# Altium schematic sheet USBC.SchDoc
size C; SheetNumber: 5; SheetTotal: 9
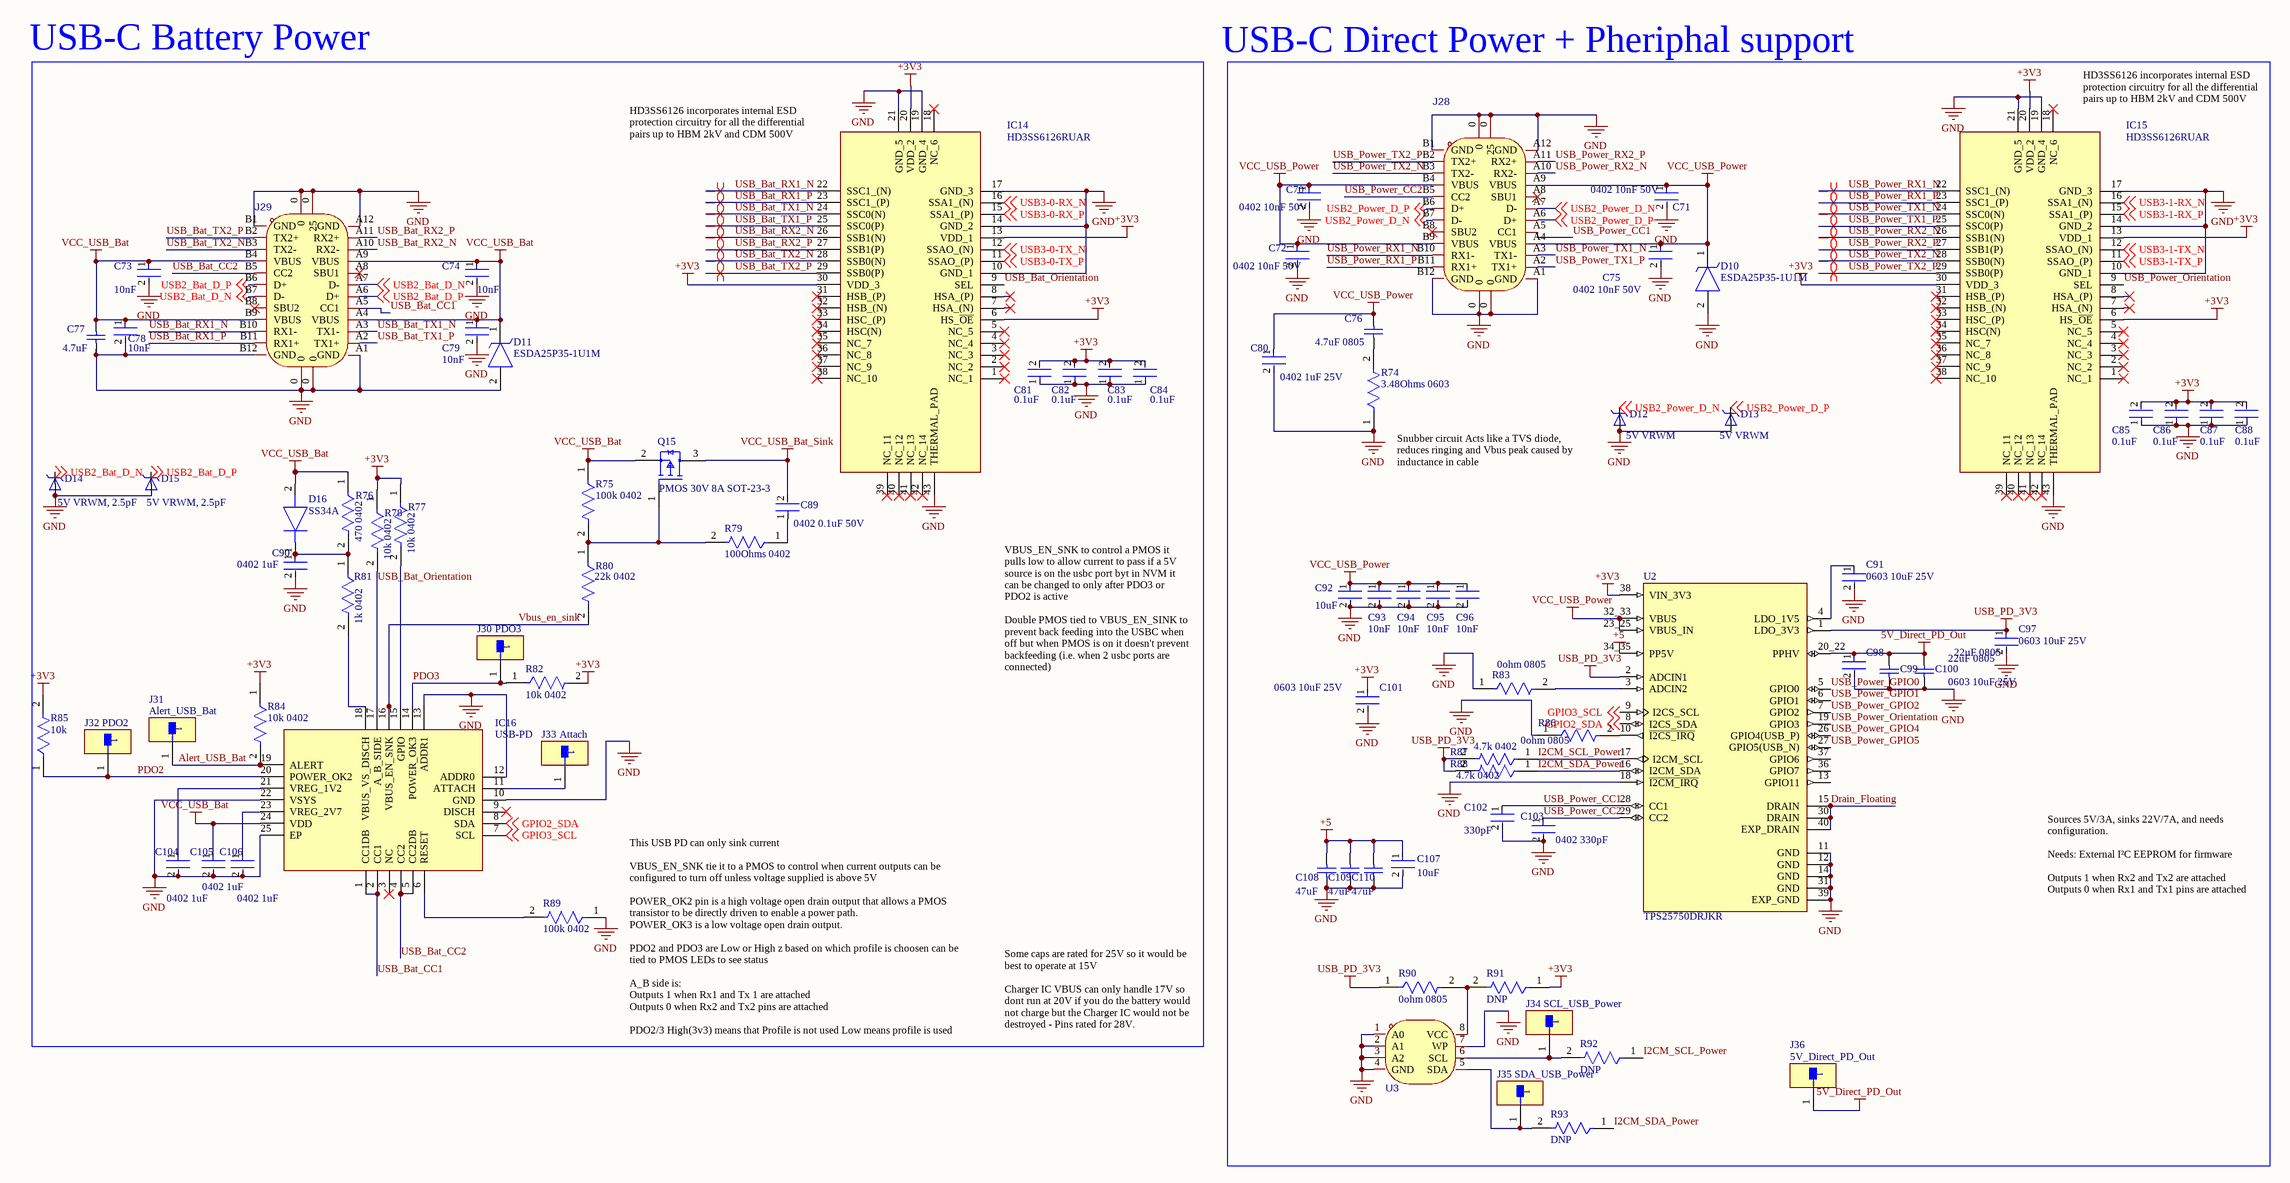
[diagram p0: USBC.SchDoc]

## Parts
C70  0402 10nF 50V  [FP-C0402-BB-MFG]
C71  0402 10nF 50V  [FP-C0402-BB-MFG]
C72  0402 10nF 50V  [FP-C0402-BB-MFG]
C73  10nF  [FP-C0402-BB-MFG]
C74  10nF  [FP-C0402-BB-MFG]
C75  0402 10nF 50V  [FP-C0402-BB-MFG]
C76  4.7uF 0805  [CAPC2013X145X50ML20T25]
C77  4.7uF  [CAPC2013X145X50ML20T25]
C78  10nF  [FP-C0402-BB-MFG]
C79  10nF  [FP-C0402-BB-MFG]
C80  0402 1uF 25V  [FP-C0402-BB-MFG]
C81  0.1uF  [FP-C0402-BB-MFG]
C82  0.1uF  [FP-C0402-BB-MFG]
C83  0.1uF  [FP-C0402-BB-MFG]
C84  0.1uF  [FP-C0402-BB-MFG]
C85  0.1uF  [FP-C0402-BB-MFG]
C86  0.1uF  [FP-C0402-BB-MFG]
C87  0.1uF  [FP-C0402-BB-MFG]
C88  0.1uF  [FP-C0402-BB-MFG]
C89  0402 0.1uF 50V  [FP-C0402-BB-MFG]
C90  0402 1uF  [FP-C0402-BB-MFG]
C91  0603 10uF 25V  [FP-CC0603-DC-MFG]
C92  10uF  [FP-CC0603-DC-MFG]
C93  10nF  [FP-C0402-BB-MFG]
C94  10nF  [FP-C0402-BB-MFG]
C95  10nF  [FP-C0402-BB-MFG]
C96  10nF  [FP-C0402-BB-MFG]
C97  0603 10uF 25V  [FP-CC0603-DC-MFG]
C98  0603 10uF 25V  [FP-CC0603-DC-MFG]
C99  22uF 0805  [CAPC2013X94X50LL20T25]
C100  22uF 0805  [CAPC2013X94X50LL20T25]
C101  0603 10uF 25V  [FP-CC0603-DC-MFG]
C102  330pF  [FP-C0402-BB-MFG]
C103  0402 330pF  [FP-C0402-BB-MFG]
C104  0402 1uF  [FP-C0402-BB-MFG]
C105  0402 1uF  [FP-C0402-BB-MFG]
C106  0402 1uF  [FP-C0402-BB-MFG]
C107  10uF  [FP-CC0603-DC-MFG]
C108  47uF  [CAPC1206(3216)100_N]
C109  47uF  [CAPC1206(3216)100_N]
C110  47uF  [CAPC1206(3216)100_N]
D10  ESDA25P35-1U1M  [ESDA25P351U1M]
D11  ESDA25P35-1U1M  [ESDA25P351U1M]
D12  5V VRWM  [SODFL1060X40N]
D13  5V VRWM  [SODFL1060X40N]
D14  5V VRWM, 2.5pF  [SODFL1060X40N]
D15  5V VRWM, 2.5pF  [SODFL1060X40N]
D16  SS34A  [DIOM5026X262N]
IC14  HD3SS6126RUAR  [QFN50P350X900X80-43N-D]
IC15  HD3SS6126RUAR  [QFN50P350X900X80-43N-D]
IC16  USB-PD  [QFN50P400X400X100-25N-D]
J28  1054500101  [USB-C-SMD_TYPE-C-USB-18]  (value not drawn)
J29  1054500101  [USB-C-SMD_TYPE-C-USB-18]  (value not drawn)
J30  PDO3  [FP-5015-MFG]
J31  Alert_USB_Bat  [FP-5015-MFG]
J32  PDO2  [FP-5015-MFG]
J33  Attach  [FP-5015-MFG]
J34  SCL_USB_Power  [FP-TSW-101-07-L-S-MFG]
J35  SDA_USB_Power  [FP-TSW-101-07-L-S-MFG]
J36  5V_Direct_PD_Out  [FP-5015-MFG]
Q15  PMOS 30V 8A SOT-23-3  [FP-SOT23-MFG]
R74  3.48Ohms 0603  [FP-RMCF0603-IPC_A]
R75  100k 0402  [FP-RMCF0402-MFG]
R76  470 0402  [FP-RMCF0402-MFG]
R77  10k 0402  [FP-RMCF0402-MFG]
R78  10k 0402  [FP-RMCF0402-MFG]
R79  100Ohms 0402  [FP-RMCF0402-MFG]
R80  22k 0402  [FP-RMCF0402-MFG]
R81  1k 0402  [FP-RMCF0402-MFG]
R82  10k 0402  [FP-RMCF0402-MFG]
R83  0ohm 0805  [FP-RN73R2A-IPC_C]
R84  10k 0402  [FP-RMCF0402-MFG]
R85  10k  [FP-RMCF0402-MFG]
R86  0ohm 0805  [FP-RN73R2A-IPC_C]
R87  4.7k 0402  [FP-RMCF0402-MFG]
R88  4.7k 0402  [FP-RMCF0402-MFG]
R89  100k 0402  [FP-RMCF0402-MFG]
R90  0ohm 0805  [FP-RN73R2A-IPC_C]
R91  DNP  [FP-RN73R2A-IPC_C]
R92  DNP  [FP-RN73R2A-IPC_C]
R93  DNP  [FP-RN73R2A-IPC_C]
U2  TPS25750DRJKR  [IC_TPS25750DRJKR]
U3  BL24C256A-SFRC  [TSSOP-8_L4.4-W3.0-P0.65-LS6.4-BL]  (value not drawn)

## Blocks framed on the sheet
USB-C Battery Power: C73 C74 C77-C79 C81-C84 C89 C90 C104-C106 D11 D14-D16 IC14 IC16 J29-J33 Q15 R75-R82 R84 R85 R89

## Nets
5V_Direct_PD_Out: C98.1 C99.1 C100.1 J36.1 U2.20_22(PPHV)
+3V3: C81.2 C82.2 C83.2 C84.2 C85.2 C86.2 C87.2 C88.2 C101.1 IC14.6(HS_~{OE}) IC14.13(VDD_1) IC14.20(VDD_2) IC14.30(VDD_3) IC15.6(HS_~{OE}) IC15.13(VDD_1) IC15.20(VDD_2) IC15.30(VDD_3) R77.1 R78.1 R82.2 R84.1 R85.2 R91.1 U2.38(VIN_3V3)
+5: C107.1 C108.2 C109.2 C110.2 U2.34_35(PP5V)
GND: C70.2 C71.2 C72.2 C73.2 C74.2 C75.2 C77.1 C78.2 C79.2 C80.2 C81.1 C82.1 C83.1 C84.1 C85.1 C86.1 C87.1 C88.1 C90.2 C91.2 C92.2 C93.2 C94.2 C95.2 C96.2 C97.2 C98.2 C99.2 C100.2 C101.2 C102.2 C103.2 C104.2 C105.2 C106.2 C107.2 C108.1 C109.1 C110.1 D10.2(A) D11.2(A) D12.2 D13.2 D14.2 D15.2 IC14.10(GND_1) IC14.14(GND_2) IC14.17(GND_3) IC14.19(GND_4) IC14.21(GND_5) IC14.43(THERMAL_PAD) IC15.10(GND_1) IC15.14(GND_2) IC15.17(GND_3) IC15.19(GND_4) IC15.21(GND_5) IC15.43(THERMAL_PAD) IC16.10(GND) IC16.12(ADDR0) IC16.13(ADDR1) IC16.22(VSYS) IC16.25(EP) J28.0 J28.A1(GND) J28.A12(GND) J28.B1(GND) J28.B12(GND) J29.0 J29.A1(GND) J29.A12(GND) J29.B1(GND) J29.B12(GND) R74.1 R83.1 R86.1 R89.1 U2.11(GND) U2.12(GND) U2.14(GND) U2.18(~{I2CM_IRQ}) U2.31(GND) U2.39(EXP_GND) U3.1(A0) U3.2(A1) U3.3(A2) U3.4(GND) U3.7(WP)
USB_PD_3V3: C97.1 R87.2 R88.2 R90.1 U2.1(LDO_3V3) U2.2(ADCIN1)
VCC_USB_Bat: C73.1 C74.1 C77.2 C78.1 C79.1 C105.1 D11.1(K) D16.2(A) IC16.24(VDD) J29.A4(VBUS) J29.A9(VBUS) J29.B4(VBUS) J29.B9(VBUS) Q15.2(S) R75.1 R76.1
VCC_USB_Bat_Sink: C89.2 Q15.3(D)
VCC_USB_Power: C70.1 C71.1 C72.1 C75.1 C76.2 C80.1 C92.1 C93.1 C94.1 C95.1 C96.1 D10.1(K) J28.A4(VBUS) J28.A9(VBUS) J28.B4(VBUS) J28.B9(VBUS) U2.23_25(VBUS_IN) U2.32_33(VBUS)
Alert_USB_Bat: IC16.19(ALERT) J31.1 R84.2
Drain_Floating: U2.15(DRAIN) U2.30(DRAIN) U2.40(EXP_DRAIN)
GPIO2_SDA: IC16.8(SDA) U2.8(I2CS_SDA) ; off-sheet GPIO2_SDA
GPIO3_SCL: IC16.7(SCL) U2.9(I2CS_SCL) ; off-sheet GPIO3_SCL
I2CM_SCL_Power: R87.1 R92.1 U2.17(I2CM_SCL)
I2CM_SDA_Power: R88.1 R93.1 U2.16(I2CM_SDA)
PDO2: IC16.20(POWER_OK2) J32.1 R85.1
PDO3: IC16.14(POWER_OK3) J30.1 R82.1
USB2_Bat_D_N: D14.1 J29.A7(D-) J29.B7(D-) ; off-sheet USB2_Bat_D_N
USB2_Bat_D_P: D15.1 J29.A6(D+) J29.B6(D+) ; off-sheet USB2_Bat_D_P
USB2_Power_D_N: D12.1 J28.A7(D-) J28.B7(D-) ; off-sheet USB2_Power_D_N
USB2_Power_D_P: D13.1 J28.A6(D+) J28.B6(D+) ; off-sheet USB2_Power_D_P
USB3-0-RX_N: IC14.16(SSA1_(N)) ; off-sheet USB3-0-RX_N
USB3-0-RX_P: IC14.15(SSA1_(P)) ; off-sheet USB3-0-RX_P
USB3-0-TX_N: IC14.12(SSAO_(N)) ; off-sheet USB3-0-TX_N
USB3-0-TX_P: IC14.11(SSAO_(P)) ; off-sheet USB3-0-TX_P
USB3-1-RX_N: IC15.16(SSA1_(N)) ; off-sheet USB3-1-RX_N
USB3-1-RX_P: IC15.15(SSA1_(P)) ; off-sheet USB3-1-RX_P
USB3-1-TX_N: IC15.12(SSAO_(N)) ; off-sheet USB3-1-TX_N
USB3-1-TX_P: IC15.11(SSAO_(P)) ; off-sheet USB3-1-TX_P
USB_Bat_CC1: IC16.1(CC1DB) IC16.2(CC1) J29.A5(CC1)
USB_Bat_CC2: IC16.4(CC2) IC16.5(CC2DB) J29.B5(CC2)
USB_Bat_Orientation: IC14.9(SEL) IC16.17(A_B_SIDE) R78.2
USB_Bat_RX1_N: IC14.22(SSC1_(N)) J29.B10(RX1-)
USB_Bat_RX1_P: IC14.23(SSC1_(P)) J29.B11(RX1+)
USB_Bat_RX2_N: IC14.26(SSB1(N)) J29.A10(RX2-)
USB_Bat_RX2_P: IC14.27(SSB1(P)) J29.A11(RX2+)
USB_Bat_TX1_N: IC14.24(SSC0(N)) J29.A3(TX1-)
USB_Bat_TX1_P: IC14.25(SSC0(P)) J29.A2(TX1+)
USB_Bat_TX2_N: IC14.28(SSB0(N)) J29.B3(TX2-)
USB_Bat_TX2_P: IC14.29(SSB0(P)) J29.B2(TX2+)
USB_Power_CC1: C102.1 J28.A5(CC1) U2.28(CC1)
USB_Power_CC2: C103.1 J28.B5(CC2) U2.29(CC2)
USB_Power_GPIO0: U2.5(GPIO0)
USB_Power_GPIO1: U2.6(GPIO1)
USB_Power_GPIO2: U2.7(GPIO2)
USB_Power_GPIO4: U2.26(GPIO4(USB_P))
USB_Power_GPIO5: U2.27(GPIO5(USB_N))
USB_Power_Orientation: IC15.9(SEL) U2.19(GPIO3)
USB_Power_RX1_N: IC15.22(SSC1_(N)) J28.B10(RX1-)
USB_Power_RX1_P: IC15.23(SSC1_(P)) J28.B11(RX1+)
USB_Power_RX2_N: IC15.26(SSB1(N)) J28.A10(RX2-)
USB_Power_RX2_P: IC15.27(SSB1(P)) J28.A11(RX2+)
USB_Power_TX1_N: IC15.24(SSC0(N)) J28.A3(TX1-)
USB_Power_TX1_P: IC15.25(SSC0(P)) J28.A2(TX1+)
USB_Power_TX2_N: IC15.28(SSB0(N)) J28.B3(TX2-)
USB_Power_TX2_P: IC15.29(SSB0(P)) J28.B2(TX2+)
Vbus_en_sink: IC16.16(VBUS_EN_SNK) R80.2
NetC76_1: C76.1 R74.2
NetC89_1: C89.1 R79.1
NetC90_1: C90.1 D16.1(K) R76.2 R81.1
NetC91_1: C91.1 U2.4(LDO_1V5)
NetC104_1: C104.1 IC16.21(VREG_1V2)
NetC106_1: C106.1 IC16.23(VREG_2V7)
NetIC16_6: IC16.6(RESET) R89.2
NetIC16_11: IC16.11(ATTACH) J33.1
NetIC16_15: IC16.15(GPIO) R77.2
NetIC16_18: IC16.18(VBUS_VS_DISCH) R81.2
NetJ34_1: J34.1 R92.2 U3.6(SCL)
NetJ35_1: J35.1 R93.2 U3.5(SDA)
NetQ15_1: Q15.1(G) R75.2 R79.2 R80.1
NetR83_2: R83.2 U2.3(ADCIN2)
NetR86_2: R86.2 U2.10(~{I2CS_IRQ})
NetR90_2: R90.2 R91.2 U3.8(VCC)

Not connected (* = marked no-connect by the designer): IC14 1(NC_1)* 2(NC_2)* 3(NC_3)* 4(NC_4)* 5(NC_5)* 7(HSA_(N))* 8(HSA_(P))* 18(NC_6)* 31(HSB_(P))* 32(HSB_(N))* 33(HSC_(P))* 34(HSC(N))* 35(NC_7)* 36(NC_8)* 37(NC_9)* 38(NC_10)* 39(NC_11)* 40(NC_12)* 41(NC_13)* 42(NC_14)*; IC15 1(NC_1)* 2(NC_2)* 3(NC_3)* 4(NC_4)* 5(NC_5)* 7(HSA_(N))* 8(HSA_(P))* 18(NC_6)* 31(HSB_(P))* 32(HSB_(N))* 33(HSC_(P))* 34(HSC(N))* 35(NC_7)* 36(NC_8)* 37(NC_9)* 38(NC_10)* 39(NC_11)* 40(NC_12)* 41(NC_13)* 42(NC_14)*; IC16 3(NC)* 9(DISCH)*; J28 A8(SBU1)* B8(SBU2)*; J29 A8(SBU1)* B8(SBU2)*; U2 13(GPIO11) 36(GPIO7) 37(GPIO6)

## Layout directives
differential pair: USB_Bat_RX1_N, USB_Bat_RX1_P, USB_Bat_RX2_N, USB_Bat_RX2_P, USB_Bat_TX1_N, USB_Bat_TX1_P, USB_Bat_TX2_N, USB_Bat_TX2_P, USB_Power_RX1_N, USB_Power_RX1_P, USB_Power_RX2_N, USB_Power_RX2_P, USB_Power_TX1_N, USB_Power_TX1_P, USB_Power_TX2_N, USB_Power_TX2_P

## Notes on the sheet
- USB-C Direct Power + Pheriphal support
- (near IC14) HD3SS6126 incorporates internal ESD protection circuitry for all the differential pairs up to HBM 2kV and CDM 500V
- (near IC15) HD3SS6126 incorporates internal ESD protection circuitry for all the differential pairs up to HBM 2kV and CDM 500V
- Snubber circuit Acts like a TVS diode, reduces ringing and Vbus peak caused by inductance in cable
- VBUS_EN_SNK to control a PMOS it pulls low to allow current to pass if a 5V source is on the usbc port byt in NVM it can be changed to only after PDO3 or PDO2 is active
  Double PMOS tied to VBUS_EN_SINK to prevent back feeding into the USBC when off but when PMOS is on it doesn't prevent backfeeding (i.e. when 2 usbc ports are connected)
- Sources 5V/3A, sinks 22V/7A, and needs configuration.
  Needs: External I²C EEPROM for firmware
  Outputs 1 when Rx2 and Tx2 are attached
  Outputs 0 when Rx1 and Tx1 pins are attached
- This USB PD can only sink current
  VBUS_EN_SNK tie it to a PMOS to control when current outputs can be configured to turn off unless voltage supplied is above 5V
  POWER_OK2 pin is a high voltage open drain output that allows a PMOS transistor to be directly driven to enable a power path.
  POWER_OK3 is a low voltage open drain output.
  PDO2 and PDO3 are Low or High z based on which profile is choosen can be tied to PMOS LEDs to see status
  A_B side is:
  Outputs 1 when Rx1 and Tx 1 are attached
  Outputs 0 when Rx2 and Tx2 pins are attached
  PDO2/3 High(3v3) means that Profile is not used Low means profile is used
- Some caps are rated for 25V so it would be best to operate at 15V
  Charger IC VBUS can only handle 17V so dont run at 20V if you do the battery would not charge but the Charger IC would not be destroyed - Pins rated for 28V.

## Library data of the parts
C70-C75 C78 C79 C93-C96 = CMP-03020-014070-2: C15195; Manufacturer: Kemet; Manufacturer Part Number: C0402C104M3PAC7867; Material: Ceramic; Tolerance: 0.2; Temperature Characteristic: X5R; Value: 0.10 μF; Temperature Coefficient: 15%; Voltage Rating: 25 V; Height: 0.55mm; Category: Cap; Temperature: -55°C to +125°C; Automotive: No; Package: C0402-BB; Temperature Range Low: -55°C; ComponentLink2Description: Datasheet; Device Class L3: Ceramic Capacitors; ComponentLink2URL: https://content.kemet.com/datasheets/KEM_C1002_X7R_SMD.pdf; Octopart: https://octopart.com/c0402c104m3pac7867-kemet-84304880; RoHS: TRUE; Temperature Range High: +125°C; Device Class L1: Passive Components; Capacitance: 0.10 μF; Lead Free: Yes; Ipc Land Pattern Name: CAPC10050X50; Device Class L2: Capacitors; Digikey Description: CAP CER 0.1UF 25V X5R 0402
C76 C77 = CMP-2007-01094-1: C7472970; Manufacturer: Kemet; Part Number: C0805F223K5RACTU
C80 = CMP-03020-014070-2: C52923; Manufacturer: Kemet; Manufacturer Part Number: C0402C104M3PAC7867; Material: Ceramic; Tolerance: 0.2; Temperature Characteristic: X5R; Value: 0.10 μF; Temperature Coefficient: 15%; Height: 0.55mm; Category: Cap; Temperature: -55°C to +125°C; Automotive: No; Package: C0402-BB; Temperature Range Low: -55°C; ComponentLink2Description: Datasheet; Device Class L3: Ceramic Capacitors; ComponentLink2URL: https://content.kemet.com/datasheets/KEM_C1002_X7R_SMD.pdf; Octopart: https://octopart.com/c0402c104m3pac7867-kemet-84304880; RoHS: TRUE; Temperature Range High: +125°C; Device Class L1: Passive Components; Capacitance: 0.10 μF; Lead Free: Yes; Voltage Rating: 25 V; Ipc Land Pattern Name: CAPC10050X50; Device Class L2: Capacitors; Digikey Description: CAP CER 0.1UF 25V X5R 0402
C81-C89 = CMP-03020-014070-2: C307331; Manufacturer: Kemet; Manufacturer Part Number: C0402C104M3PAC7867; Material: Ceramic; Tolerance: 0.2; Temperature Characteristic: X5R; Value: 0.10 μF; Temperature Coefficient: 15%; Voltage Rating: 25 V; Height: 0.55mm; Category: Cap; Temperature: -55°C to +125°C; Automotive: No; Package: C0402-BB; Temperature Range Low: -55°C; ComponentLink2Description: Datasheet; Device Class L3: Ceramic Capacitors; ComponentLink2URL: https://content.kemet.com/datasheets/KEM_C1002_X7R_SMD.pdf; Octopart: https://octopart.com/c0402c104m3pac7867-kemet-84304880; RoHS: TRUE; Temperature Range High: +125°C; Device Class L1: Passive Components; Capacitance: 0.10 μF; Lead Free: Yes; Ipc Land Pattern Name: CAPC10050X50; Device Class L2: Capacitors; Digikey Description: CAP CER 0.1UF 25V X5R 0402
C90 C104-C106 = CMP-03020-014070-2: C52923; Manufacturer: Kemet; Manufacturer Part Number: C0402C104M3PAC7867; Material: Ceramic; Tolerance: 0.2; Temperature Characteristic: X5R; Value: 0.10 μF; Temperature Coefficient: 15%; Voltage Rating: 25 V; Height: 0.55mm; Category: Cap; Temperature: -55°C to +125°C; Automotive: No; Package: C0402-BB; Temperature Range Low: -55°C; ComponentLink2Description: Datasheet; Device Class L3: Ceramic Capacitors; ComponentLink2URL: https://content.kemet.com/datasheets/KEM_C1002_X7R_SMD.pdf; Octopart: https://octopart.com/c0402c104m3pac7867-kemet-84304880; RoHS: TRUE; Temperature Range High: +125°C; Device Class L1: Passive Components; Capacitance: 0.10 μF; Lead Free: Yes; Ipc Land Pattern Name: CAPC10050X50; Device Class L2: Capacitors; Digikey Description: CAP CER 0.1UF 25V X5R 0402
C91 C92 C97 C98 C101 C107 = CMP-00621-81932632-1: C96446; Capacitance: 10µF; Voltage Rating: 16V; Dielectric: X5R; Material: Ceramic; Tolerance: 10%; NexarPartId: 81932632; Height: 1mm; Halogen Free: Halogen Free; Max Operating Temperature: 85°C; Voltage Rating (DC): 16V; Lead Free: Lead Free; RoHS: Non-Compliant; Min Operating Temperature: -55°C; Case/Package: 0603
C99 C100 = CMP-2007-04160-1: C45783; Part Number: 08051C102KAT4A; Manufacturer: AVX Interconnect / Elco
C102 C103 = CMP-03020-014070-2: C13533; Manufacturer: Kemet; Manufacturer Part Number: C0402C104M3PAC7867; Material: Ceramic; Tolerance: 0.2; Temperature Characteristic: X5R; Value: 0.10 μF; Temperature Coefficient: 15%; Voltage Rating: 25 V; Height: 0.55mm; Category: Cap; Temperature: -55°C to +125°C; Automotive: No; Package: C0402-BB; Temperature Range Low: -55°C; ComponentLink2Description: Datasheet; Device Class L3: Ceramic Capacitors; ComponentLink2URL: https://content.kemet.com/datasheets/KEM_C1002_X7R_SMD.pdf; Octopart: https://octopart.com/c0402c104m3pac7867-kemet-84304880; RoHS: TRUE; Temperature Range High: +125°C; Device Class L1: Passive Components; Capacitance: 0.10 μF; Lead Free: Yes; Ipc Land Pattern Name: CAPC10050X50; Device Class L2: Capacitors; Digikey Description: CAP CER 0.1UF 25V X5R 0402
C108-C110 = CMP-1037-01579-1: C7472975; Case-Metric: 3216; Tolerance: Â±1%; Rated Voltage: 100 V; Case-EIA: 1206; Value: 100pF; Max Thickness: 1 mm; Technology: SMT
D10 D11 = ESDA25P35-1U1M: C1974707; Manufacturer_Name: STMicroelectronics; Datasheet Link: https://www.st.com/resource/en/datasheet/esda20p50-1u1m.pdf; Height: 0.6mm; Manufacturer_Part_Number: ESDA25P35-1U1M; Mouser Part Number: 511-ESDA25P35-1U1M; Mouser Price/Stock: https://www.mouser.co.uk/ProductDetail/STMicroelectronics/ESDA25P35-1U1M?qs=aVyJF2WnouQUWqgNP85ZrA%3D%3D; Arrow Part Number: ESDA25P35-1U1M; Arrow Price/Stock: https://www.arrow.com/en/products/esda25p35-1u1m/stmicroelectronics.html?utm_currency=USD&region=nac
D12-D15 = ESD9M5.0ST5G: C242267; MF: ON Semiconductor; Mouser-Purchase-URL: https://snapeda.com/shop?store=Mouser&id=218558; Price: None; Package: SOD-923 ON Semiconductor; Value: *; MP: ESD9M5.0ST5G; SnapEDA_Link: https://www.snapeda.com/parts/ESD9M5.0ST5G/ON%20Semiconductor/view-part/218558/?ref=snap; Availability: Warning; BuyPart: https://www.snapeda.com/parts/ESD9M5.0ST5G/ON%20Semiconductor/view-part/218558/?ref=eda
D16 = SS34A: C8678; Manufacturer_Name: HY Electronic; Datasheet Link: https://datasheet.datasheetarchive.com/originals/distributors/Datasheets-3/DSA-43252.pdf; Height: 2.62mm; Manufacturer_Part_Number: SS34A
IC14 IC15 = HD3SS6126RUAR: C701818; Manufacturer_Name: Texas Instruments; Datasheet Link: http://www.ti.com/lit/gpn/hd3ss6126; Height: 0.8mm; Manufacturer_Part_Number: HD3SS6126RUAR; Mouser Part Number: 595-HD3SS6126RUAR; Mouser Price/Stock: https://www.mouser.co.uk/ProductDetail/Texas-Instruments/HD3SS6126RUAR?qs=3oHdzXquMOxuOQpaguz6Og%3D%3D; Arrow Part Number: HD3SS6126RUAR; Arrow Price/Stock: https://www.arrow.com/en/products/hd3ss6126ruar/texas-instruments?region=nac
IC16 = STUSB4500QTR: C2678061; Manufacturer_Name: STMicroelectronics; Datasheet Link: https://www.st.com/resource/en/datasheet/stusb4500.pdf; Height: 1mm; Manufacturer_Part_Number: STUSB4500QTR; Mouser Part Number: 511-STUSB4500QTR; Mouser Price/Stock: https://www.mouser.co.uk/ProductDetail/STMicroelectronics/STUSB4500QTR?qs=wUXugUrL1qyQbYMSzG1ujg%3D%3D; Arrow Part Number: STUSB4500QTR; Arrow Price/Stock: https://www.arrow.com/en/products/stusb4500qtr/stmicroelectronics?utm_currency=USD&region=europe
J28 J29 = 1054500101: C134092; Manufacturer: MOLEX; Symbol: 105450-0101; Add into BOM: yes; Connector Type: Type-C; Protocol Standard: USB 3.2; Gender: Female; Number of Contacts: 24P; Number of Ports: 1; Voltage Rating: 30V; Connect-Disconnect Life: 10,000 Cycles; Detection color: Black; Device: 1054500101; LCSC Part Name: Type-C 母; Supplier Part: C134092; Manufacturer Part: 1054500101; Supplier Footprint: SMD; JLCPCB Part Class: Extended Part; Datasheet: https://www.molex.com/content/dam/molex/molex-dot-com/products/automated/en-us/salesdrawingpdf/105/105450/1054500101_sd.pdf?inline\; Supplier: LCSC; Convert to PCB: yes; Current Rating-Power: -; Operating Temperature: -30℃~+85℃
J30-J33 J36 = CMP-2000-05183-2: PC TEST POINT MINIATURE; Manufacturer Part Number: 5015; Manufacturer: keystone; Number Of Contacts: 1; Conn Orientation: Straight; Category: Conn; Digikey Description: PC TEST POINT MINIATURE; Automotive: No; Lead Free: Yes; Octopart: https://octopart.com/5015-keystone-3822; ComponentLink2URL: http://www.keyelco.com/product-pdf.cfm?p=1353; Package: 5015; RoHS: TRUE; Device Class L3: unset; Device Class L2: unset; Contact Material: Silver; Device Class L1: Connectors; Height: 1.65mm; ComponentLink2Description: Datasheet
J34 J35 = CMP-02766-001775-1: CONN HEADER VERT 1POS; Gender: Male; Number of Contacts: 1; Max Current Rating: 7.6A; Max Voltage Rating (AC): 550V; RoHS Compliant: Yes; Contact Finish - Mating: GOLD; Length: 2.54mm; Series: TSW; Insulation Material: PBT; Reach SVHC Compliant: Yes; Radiation Hardening: No; Contact Plating: Gold; Termination: Solder; Contact Type: Male Pin; Orientation: Straight; Number of Rows: 1; Depth: 2.54mm; Housing Material: Polyester; Lead Free: Lead Free; Fastening Type: Pull; Flammability Rating: UL94 V-0; Mount: Through Hole; Housing Color: Black; Contact Shape: Square; Min Operating Temperature: -55°C; Connector Type: Header; Contact Mating Length: 0.23inch; Width: 2.54mm; Packaging: Bulk; Contact Material: Bronze; Max Operating Temperature: 125°C; Number of Positions: 1; Color: Black; Insulation Color: Black
Q15 = CMP-12801-000021-1: C48934562; Manufacturer: Diodes Inc.; Manufacturer Part Number: DMG2305UX-13; Input Capacitace At Vds: 808pF @ -15V; Rthja Max: 90°C/W; Drain To Source Voltage: -20V; Standoff Height: 0.013mm; Number Of P Channels: 1; Gate To Source Voltage: 8V; Turn On Delay Time: 10.8ns; Pulse Drain Current: -15A; Threshold Vgs Max: -0.9V; Max Junction Temp: +150°C; Depletion Mode: False; Drain To Source Resistance: 40mΩ; Threshold Vgs Min: -0.5V; Continuous Drain Current: -4.2A; Turn Off Delay Time: 79.3ns; Gate Charge At Vgs: 10.2nC @ -4.5V; Power Dissipation: 1.4W; Digikey Description: MOSFET P-CH 20V 4.2A SOT23; Temperature Range High: +150°C; Height: 1.1mm; Package: SOT23; Footprint Url: https://www.diodes.com/assets/Package-Files/SOT23.pdf; Device Class L3: MOSFETs; RoHS: TRUE; Temperature: -55°C to +150°C; Mouser Description: MOSFET P-Ch ENH FET -20V 52mOhm -5.0V; Temperature Range Low: -55°C; ComponentLink2Description: Datasheet; Octopart: https://octopart.com/dmg2305ux-13-diodes+inc.-29925594; Ipc Land Pattern Name: SOT92P240X102-3; Device Class L2: Transistors; Automotive: No; Number Of Channels: 1; Drain To Source Breakdown Voltage: -20V; Lead Free: Yes; Device Class L1: Discrete Semiconductors; Category: Trans; ComponentLink2URL: https://www.diodes.com/assets/Datasheets/DMG2305UX.pdf
R74 = CMP-26527-005729-1: C322150; Tolerance: 1%; Temperature Coefficient: 100ppm/°C; Max Power Dissipation: 100mW; Resistance: 1.02kR; Mount: Surface Mount; Max Operating Temperature: 155°C; Number of Terminations: 2; Radiation Hardening: No; Series: RMCF; Resistor Type: Thick Film; Min Operating Temperature: -55°C; Case/Package: 0603; Packaging: Tape and Reel; Features: Automotive AEC-Q200; Contact Plating: Tin; Length: 0.061inch; RoHS Compliant: Yes; Width: 0.031inch; Height: 0.022inch
R75 R89 = CMP-26527-002093-1: C25741; Max Power Dissipation: 63mW; Tolerance: 5%; Resistance: 3.9R; Temperature Coefficient: 200ppm/°C; Case/Package: 0402; Number of Terminations: 2; Min Operating Temperature: -55°C; Height: 0.016inch; Packaging: Tape and Reel; Resistor Type: Thick Film; Length: 0.039inch; Mount: Surface Mount; Series: RMCF; Max Operating Temperature: 155°C; Contact Plating: Tin; Features: Automotive AEC-Q200; Width: 0.02inch; Radiation Hardening: No; RoHS Compliant: Yes
R76 = CMP-26527-002093-1: C25117; Max Power Dissipation: 63mW; Tolerance: 5%; Resistance: 3.9R; Temperature Coefficient: 200ppm/°C; Case/Package: 0402; Number of Terminations: 2; Min Operating Temperature: -55°C; Height: 0.016inch; Packaging: Tape and Reel; Resistor Type: Thick Film; Length: 0.039inch; Mount: Surface Mount; Series: RMCF; Max Operating Temperature: 155°C; Contact Plating: Tin; Features: Automotive AEC-Q200; Width: 0.02inch; Radiation Hardening: No; RoHS Compliant: Yes
R77 R78 R82 R84 R85 = CMP-26527-002093-1: C25744; Max Power Dissipation: 63mW; Tolerance: 5%; Resistance: 3.9R; Temperature Coefficient: 200ppm/°C; Case/Package: 0402; Number of Terminations: 2; Min Operating Temperature: -55°C; Height: 0.016inch; Packaging: Tape and Reel; Resistor Type: Thick Film; Length: 0.039inch; Mount: Surface Mount; Series: RMCF; Max Operating Temperature: 155°C; Contact Plating: Tin; Features: Automotive AEC-Q200; Width: 0.02inch; Radiation Hardening: No; RoHS Compliant: Yes
R79 = CMP-26527-002093-1: C25076; Max Power Dissipation: 63mW; Tolerance: 5%; Resistance: 3.9R; Temperature Coefficient: 200ppm/°C; Case/Package: 0402; Number of Terminations: 2; Min Operating Temperature: -55°C; Height: 0.016inch; Packaging: Tape and Reel; Resistor Type: Thick Film; Length: 0.039inch; Mount: Surface Mount; Series: RMCF; Max Operating Temperature: 155°C; Contact Plating: Tin; Features: Automotive AEC-Q200; Width: 0.02inch; Radiation Hardening: No; RoHS Compliant: Yes
R80 = CMP-26527-002093-1: C25768; Max Power Dissipation: 63mW; Tolerance: 5%; Resistance: 3.9R; Temperature Coefficient: 200ppm/°C; Case/Package: 0402; Number of Terminations: 2; Min Operating Temperature: -55°C; Height: 0.016inch; Packaging: Tape and Reel; Resistor Type: Thick Film; Length: 0.039inch; Mount: Surface Mount; Series: RMCF; Max Operating Temperature: 155°C; Contact Plating: Tin; Features: Automotive AEC-Q200; Width: 0.02inch; Radiation Hardening: No; RoHS Compliant: Yes
R81 = CMP-26527-002093-1: C11702; Max Power Dissipation: 63mW; Tolerance: 5%; Resistance: 3.9R; Temperature Coefficient: 200ppm/°C; Case/Package: 0402; Number of Terminations: 2; Min Operating Temperature: -55°C; Height: 0.016inch; Packaging: Tape and Reel; Resistor Type: Thick Film; Length: 0.039inch; Mount: Surface Mount; Series: RMCF; Max Operating Temperature: 155°C; Contact Plating: Tin; Features: Automotive AEC-Q200; Width: 0.02inch; Radiation Hardening: No; RoHS Compliant: Yes
R83 R86 R90 = CMP-04015-014497-1: C17477
R87 R88 = CMP-26527-002093-1: C25900; Max Power Dissipation: 63mW; Tolerance: 5%; Resistance: 3.9R; Temperature Coefficient: 200ppm/°C; Case/Package: 0402; Number of Terminations: 2; Min Operating Temperature: -55°C; Height: 0.016inch; Packaging: Tape and Reel; Resistor Type: Thick Film; Length: 0.039inch; Mount: Surface Mount; Series: RMCF; Max Operating Temperature: 155°C; Contact Plating: Tin; Features: Automotive AEC-Q200; Width: 0.02inch; Radiation Hardening: No; RoHS Compliant: Yes
R91-R93 = CMP-04015-014497-1: DNP 0805
U2 = TPS25750DRJKR: C2868209; MF: Texas Instruments; Package: PowerWFQFN-38 Texas Instruments; Price: None; Check_prices: https://www.snapeda.com/parts/TPS25750DRJKR/Texas+Instruments/view-part/?ref=eda; Value: *; SnapEDA_Link: https://www.snapeda.com/parts/TPS25750DRJKR/Texas+Instruments/view-part/?ref=snap; MP: TPS25750DRJKR; Availability: In Stock; Purchase-URL: https://pricing.snapeda.com/search?q=TPS25750DRJKR&ref=eda
U3 = BL24C256A-SFRC: C110276; Manufacturer: BL(上海贝岭); Add into BOM: yes; Symbol: BL24C256A-SFRC; Device: BL24C256A-SFRC; LCSC Part Name: 256Kbits EEPROM，支持I2C协议，具有硬件写保护功能; Supplier Part: C110276; Manufacturer Part: BL24C256A-SFRC; Supplier Footprint: TSSOP-8; JLCPCB Part Class: Extended Part; Datasheet: https://atta.szlcsc.com/upload/public/pdf/source/20170428/1493376808838.pdf; Supplier: LCSC; Convert to PCB: yes